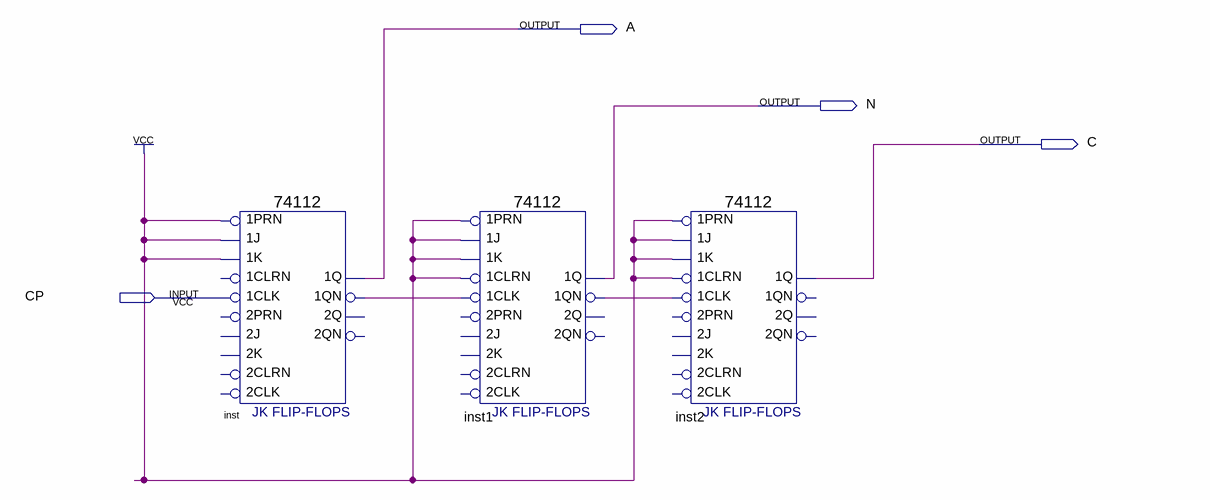
[diagram p0: schematic sheet]
// Quartus schematic ADDER.bdf as structural Verilog: 3 symbols, 4 pins
module ADDER (
  input  CP,
  output A,
  output N,
  output C
);

  wire inst1_1qn, inst_1qn;

  \74112  inst (
    .\1K (1'b1), .\1J (1'b1), .\1PRN (1'b1), .\1CLK (CP), .\1QN (inst_1qn), .\1Q (A));  // open: 1CLRN, 2K, 2J, 2PRN, 2CLK, 2CLRN, 2Q, 2QN
  \74112  inst1 (
    .\1K (1'b1), .\1J (1'b1), .\1PRN (1'b1), .\1CLK (inst_1qn), .\1CLRN (1'b1), .\1QN (inst1_1qn), .\1Q (N));  // open: 2K, 2J, 2PRN, 2CLK, 2CLRN, 2Q, 2QN
  \74112  inst2 (
    .\1K (1'b1), .\1J (1'b1), .\1PRN (1'b1), .\1CLK (inst1_1qn), .\1CLRN (1'b1), .\1Q (C));  // open: 2K, 2J, 2PRN, 2CLK, 2CLRN, 1QN, 2Q, 2QN
endmodule
